# EAGLE design piezo-driver_v0.3-R001 (EAGLE 6.5.0)
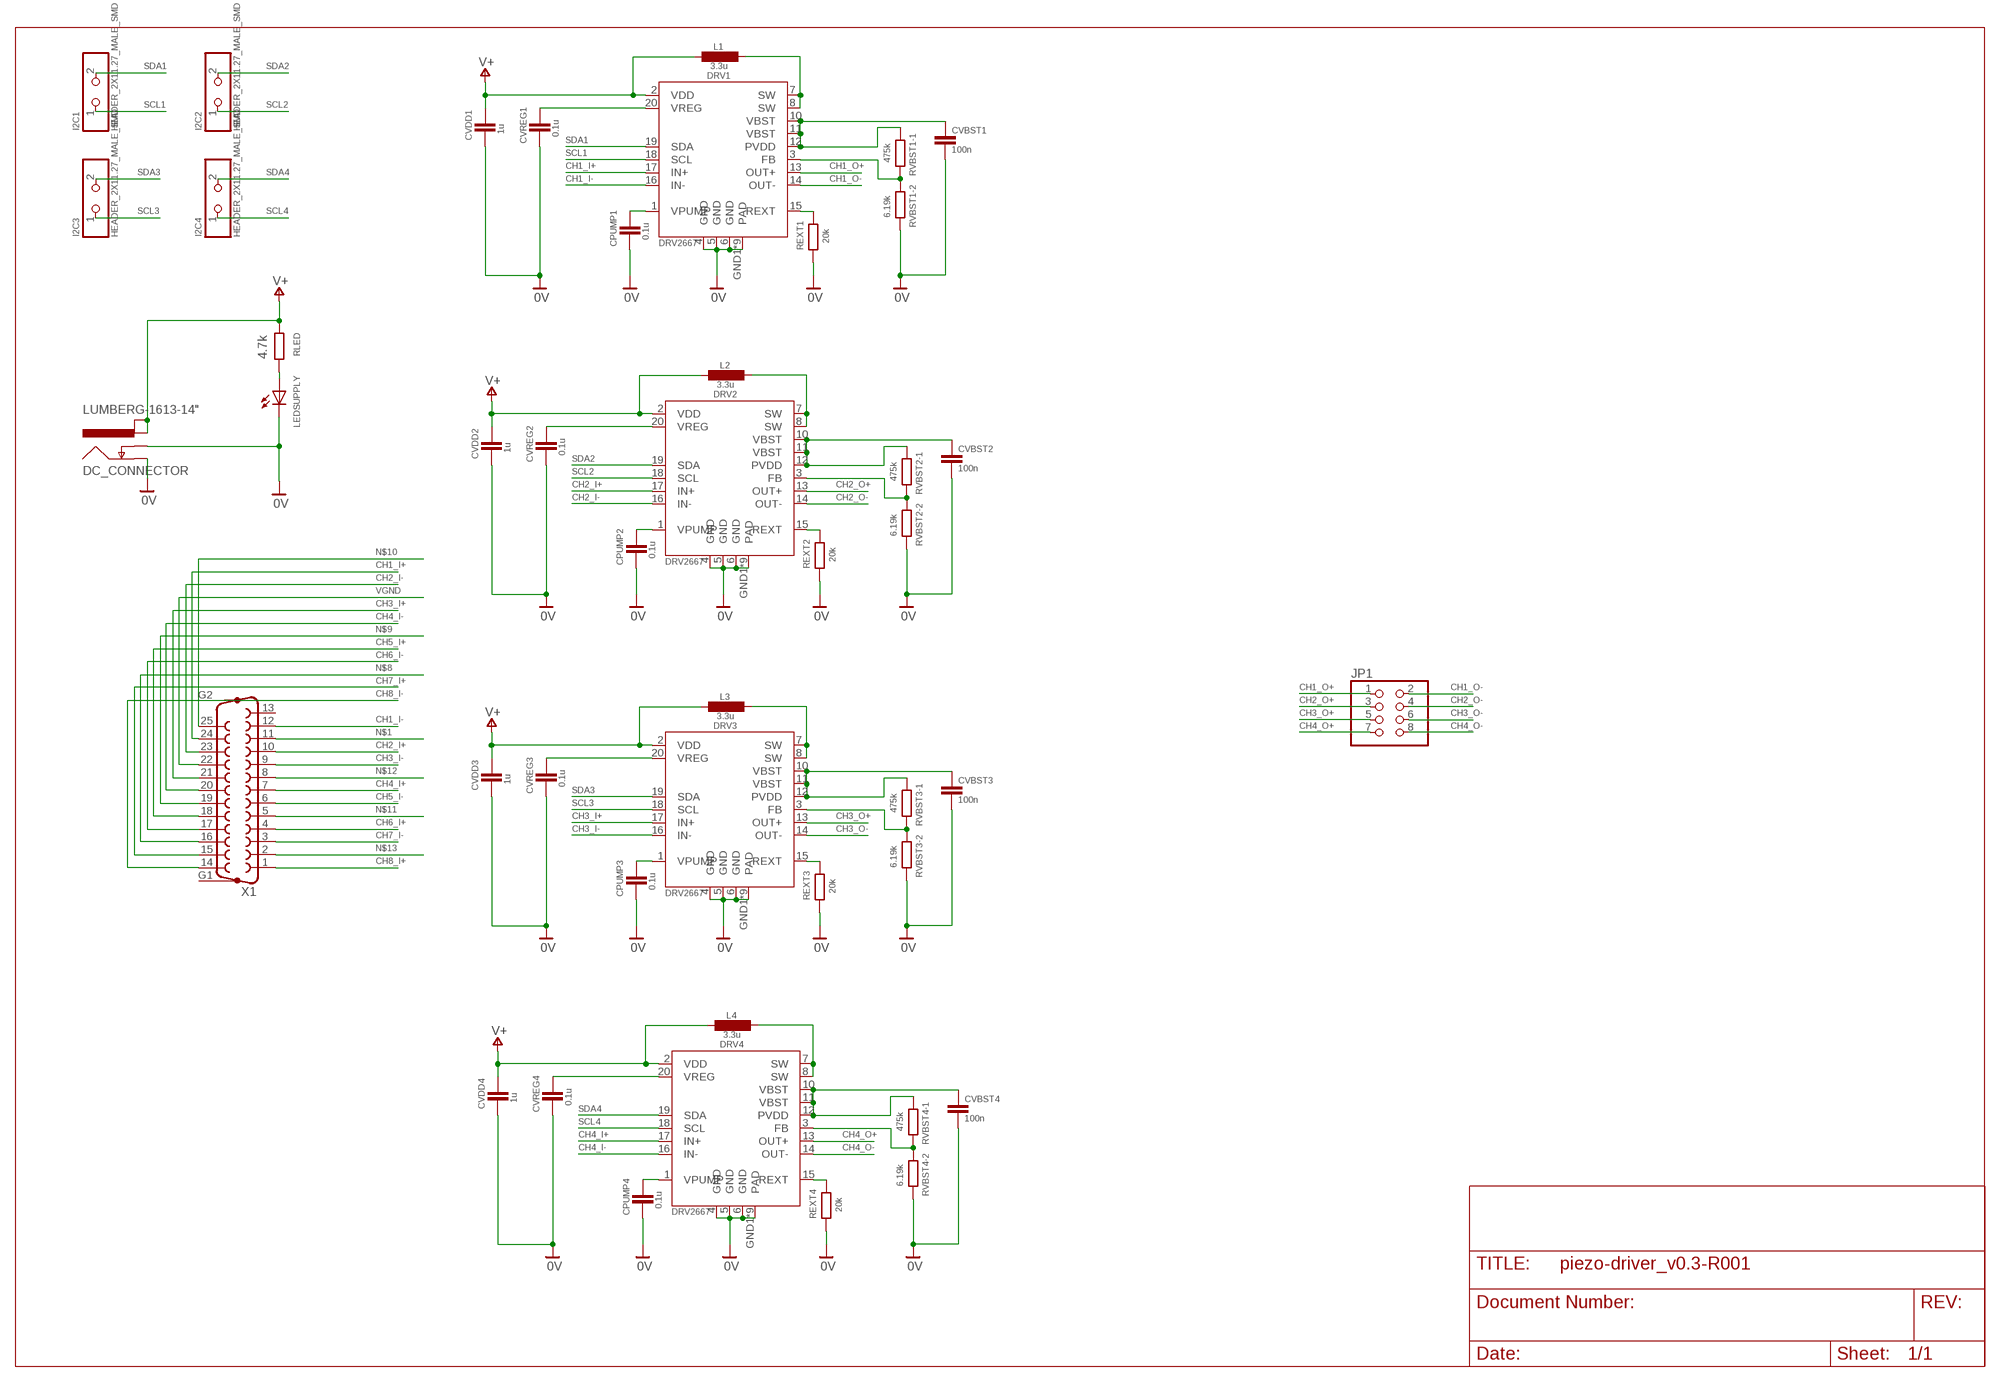
[diagram p0: schematic, sheet 1]

## Parts
CPUMP1  0.1u  C-EUC0805  [C0805]
CPUMP2  0.1u  C-EUC0805  [C0805]
CPUMP3  0.1u  C-EUC0805  [C0805]
CPUMP4  0.1u  C-EUC0805  [C0805]
CVBST1  100n  C-EUC0805  [C0805]
CVBST2  100n  C-EUC0805  [C0805]
CVBST3  100n  C-EUC0805  [C0805]
CVBST4  100n  C-EUC0805  [C0805]
CVDD1  1u  C-EUC0805  [C0805]
CVDD2  1u  C-EUC0805  [C0805]
CVDD3  1u  C-EUC0805  [C0805]
CVDD4  1u  C-EUC0805  [C0805]
CVREG1  0.1u  C-EUC0805  [C0805]
CVREG2  0.1u  C-EUC0805  [C0805]
CVREG3  0.1u  C-EUC0805  [C0805]
CVREG4  0.1u  C-EUC0805  [C0805]
DC_CONNECTOR  LUMBERG-1613-14"  [LUMBERG-1613_14]
DRV1  DRV2667QFN  [QFN400X400]
DRV2  DRV2667QFN  [QFN400X400]
DRV3  DRV2667QFN  [QFN400X400]
DRV4  DRV2667QFN  [QFN400X400]
I2C1  HEADER_2X11.27_MALE_SMD  [2X01_1.27_SMD]
I2C2  HEADER_2X11.27_MALE_SMD  [2X01_1.27_SMD]
I2C3  HEADER_2X11.27_MALE_SMD  [2X01_1.27_SMD]
I2C4  HEADER_2X11.27_MALE_SMD  [2X01_1.27_SMD]
JP1  PINHD-2X4/90  [2X04/90]
L1  3.3u  L-EUL3225M  [L3225M]
L2  3.3u  L-EUL3225M  [L3225M]
L3  3.3u  L-EUL3225M  [L3225M]
L4  3.3u  L-EUL3225M  [L3225M]
LEDSUPPLY  LED0603  [LED-0603]
REXT1  20k  R-EU_R0805  [R0805]
REXT2  20k  R-EU_R0805  [R0805]
REXT3  20k  R-EU_R0805  [R0805]
REXT4  20k  R-EU_R0805  [R0805]
RLED  4.7k  R-EU_R0805  [R0805]
RVBST1-1  475k  R-EU_R0805  [R0805]
RVBST1-2  6.19k  R-EU_R0805  [R0805]
RVBST2-1  475k  R-EU_R0805  [R0805]
RVBST2-2  6.19k  R-EU_R0805  [R0805]
RVBST3-1  475k  R-EU_R0805  [R0805]
RVBST3-2  6.19k  R-EU_R0805  [R0805]
RVBST4-1  475k  R-EU_R0805  [R0805]
RVBST4-2  6.19k  R-EU_R0805  [R0805]
X1  F25HP  [F25HP]

## Nets
0V: CPUMP1.2 CPUMP2.2 CPUMP3.2 CPUMP4.2 CVBST1.2 CVBST2.2 CVBST3.2 CVBST4.2 CVDD1.2 CVDD2.2 CVDD3.2 CVDD4.2 CVREG1.2 CVREG2.2 CVREG3.2 CVREG4.2 DC_CONNECTOR.1(GND) DC_CONNECTOR.2(GND_INS) DRV1.4(GND) DRV1.5(GND) DRV1.6(GND) DRV1.GND1(PAD) DRV1.GND2(PAD) DRV1.GND3(PAD) DRV1.GND4(PAD) DRV1.GND5(PAD) DRV1.GND6(PAD) DRV1.GND7(PAD) DRV1.GND8(PAD) DRV1.GND9(PAD) DRV2.4(GND) DRV2.5(GND) DRV2.6(GND) DRV2.GND1(PAD) DRV2.GND2(PAD) DRV2.GND3(PAD) DRV2.GND4(PAD) DRV2.GND5(PAD) DRV2.GND6(PAD) DRV2.GND7(PAD) DRV2.GND8(PAD) DRV2.GND9(PAD) DRV3.4(GND) DRV3.5(GND) DRV3.6(GND) DRV3.GND1(PAD) DRV3.GND2(PAD) DRV3.GND3(PAD) DRV3.GND4(PAD) DRV3.GND5(PAD) DRV3.GND6(PAD) DRV3.GND7(PAD) DRV3.GND8(PAD) DRV3.GND9(PAD) DRV4.4(GND) DRV4.5(GND) DRV4.6(GND) DRV4.GND1(PAD) DRV4.GND2(PAD) DRV4.GND3(PAD) DRV4.GND4(PAD) DRV4.GND5(PAD) DRV4.GND6(PAD) DRV4.GND7(PAD) DRV4.GND8(PAD) DRV4.GND9(PAD) LEDSUPPLY.C REXT1.1 REXT2.1 REXT3.1 REXT4.1 RVBST1-2.1 RVBST2-2.1 RVBST3-2.1 RVBST4-2.1
CH1_I+: DRV1.17(IN+) X1.24
CH1_I-: DRV1.16(IN-) X1.12
CH1_O+: DRV1.13(OUT+) JP1.1
CH1_O-: DRV1.14(OUT-) JP1.2
CH2_I+: DRV2.17(IN+) X1.10
CH2_I-: DRV2.16(IN-) X1.23
CH2_O+: DRV2.13(OUT+) JP1.3
CH2_O-: DRV2.14(OUT-) JP1.4
CH3_I+: DRV3.17(IN+) X1.21
CH3_I-: DRV3.16(IN-) X1.9
CH3_O+: DRV3.13(OUT+) JP1.5
CH3_O-: DRV3.14(OUT-) JP1.6
CH4_I+: DRV4.17(IN+) X1.7
CH4_I-: DRV4.16(IN-) X1.20
CH4_O+: DRV4.13(OUT+) JP1.7
CH4_O-: DRV4.14(OUT-) JP1.8
CH5_I+: X1.18
CH5_I-: X1.6
CH6_I+: X1.4
CH6_I-: X1.17
CH7_I+: X1.15
CH7_I-: X1.3
CH8_I+: X1.1
CH8_I-: X1.14
N$1: X1.11
N$2: DRV1.7(SW) DRV1.8(SW) L1.1
N$3: CVBST1.1 DRV1.10(VBST) DRV1.11(VBST) DRV1.12(PVDD) RVBST1-1.2
N$4: DRV1.3(FB) RVBST1-1.1 RVBST1-2.2
N$5: DRV1.15(REXT) REXT1.2
N$6: CPUMP1.1 DRV1.1(VPUMP)
N$7: CVREG1.1 DRV1.20(VREG)
N$8: X1.16
N$9: X1.19
N$10: X1.25
N$11: X1.5
N$12: X1.8
N$13: X1.2
N$15: LEDSUPPLY.A RLED.1
N$31: DRV2.7(SW) DRV2.8(SW) L2.1
N$32: CVBST2.1 DRV2.10(VBST) DRV2.11(VBST) DRV2.12(PVDD) RVBST2-1.2
N$33: DRV2.3(FB) RVBST2-1.1 RVBST2-2.2
N$34: DRV2.15(REXT) REXT2.2
N$35: CPUMP2.1 DRV2.1(VPUMP)
N$36: CVREG2.1 DRV2.20(VREG)
N$37: DRV3.7(SW) DRV3.8(SW) L3.1
N$38: CVBST3.1 DRV3.10(VBST) DRV3.11(VBST) DRV3.12(PVDD) RVBST3-1.2
N$39: DRV3.3(FB) RVBST3-1.1 RVBST3-2.2
N$40: DRV3.15(REXT) REXT3.2
N$41: CPUMP3.1 DRV3.1(VPUMP)
N$42: CVREG3.1 DRV3.20(VREG)
N$43: DRV4.7(SW) DRV4.8(SW) L4.1
N$44: CVBST4.1 DRV4.10(VBST) DRV4.11(VBST) DRV4.12(PVDD) RVBST4-1.2
N$45: DRV4.3(FB) RVBST4-1.1 RVBST4-2.2
N$46: DRV4.15(REXT) REXT4.2
N$47: CPUMP4.1 DRV4.1(VPUMP)
N$48: CVREG4.1 DRV4.20(VREG)
SCL1: DRV1.18(SCL) I2C1.1
SCL2: DRV2.18(SCL) I2C2.1
SCL3: DRV3.18(SCL) I2C3.1
SCL4: DRV4.18(SCL) I2C4.1
SDA1: DRV1.19(SDA) I2C1.2
SDA2: DRV2.19(SDA) I2C2.2
SDA3: DRV3.19(SDA) I2C3.2
SDA4: DRV4.19(SDA) I2C4.2
V+: CVDD1.1 CVDD2.1 CVDD3.1 CVDD4.1 DC_CONNECTOR.3(PWR_1) DC_CONNECTOR.4(PWR_2) DRV1.2(VDD) DRV2.2(VDD) DRV3.2(VDD) DRV4.2(VDD) L1.2 L2.2 L3.2 L4.2 RLED.2
VGND: X1.22
Unconnected: X1.13 X1.G1 X1.G2

## Library data of the parts
CPUMP1-CPUMP4 CVBST1-CVBST4 CVDD1-CVDD4 CVREG1-CVREG4 = SABRe:C-EU: CAPACITOR, European symbol
DC_CONNECTOR = SABRe:LUMBERG-1613-14
DRV1-DRV4 = ICST:DRV2667
I2C1-I2C4 = SABRe:HEADER_2X1
JP1 = ICST:PINHD-2X4: PIN HEADER
L1-L4 = SABRe:L-EU: INDUCTOR, European symbol
LEDSUPPLY = SABRe:LED: LEDs Standard schematic elements and footprints for packages: 5mm 3mm 1206 0603
REXT1-REXT4 RVBST1-1 RVBST1-2 RVBST2-1 RVBST2-2 RVBST3-1 RVBST3-2 RVBST4-1 RVBST4-2 = SABRe:R-EU_: RESISTOR, European symbol
RLED = rcl:R-EU_: RESISTOR, European symbol
X1 = ICST:F25HP: SUB-D; OC_FARNELL: unknown; OC_NEWARK: unknown

## Board
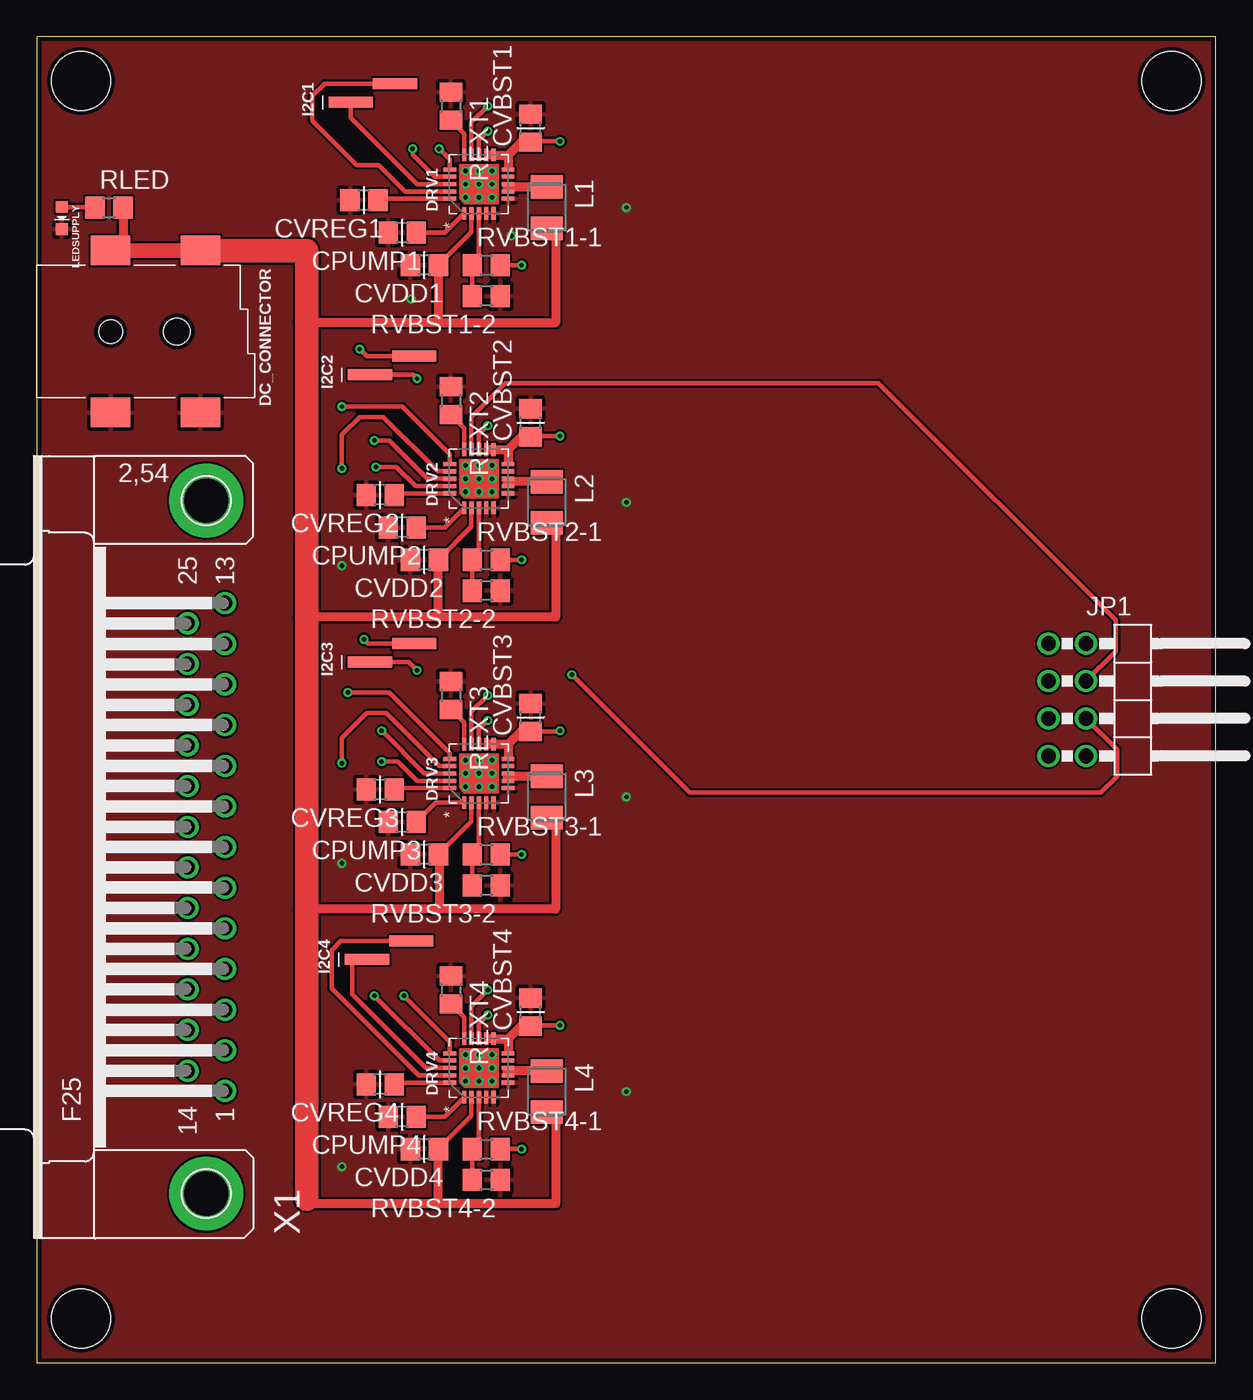
[diagram p1: board, top side]
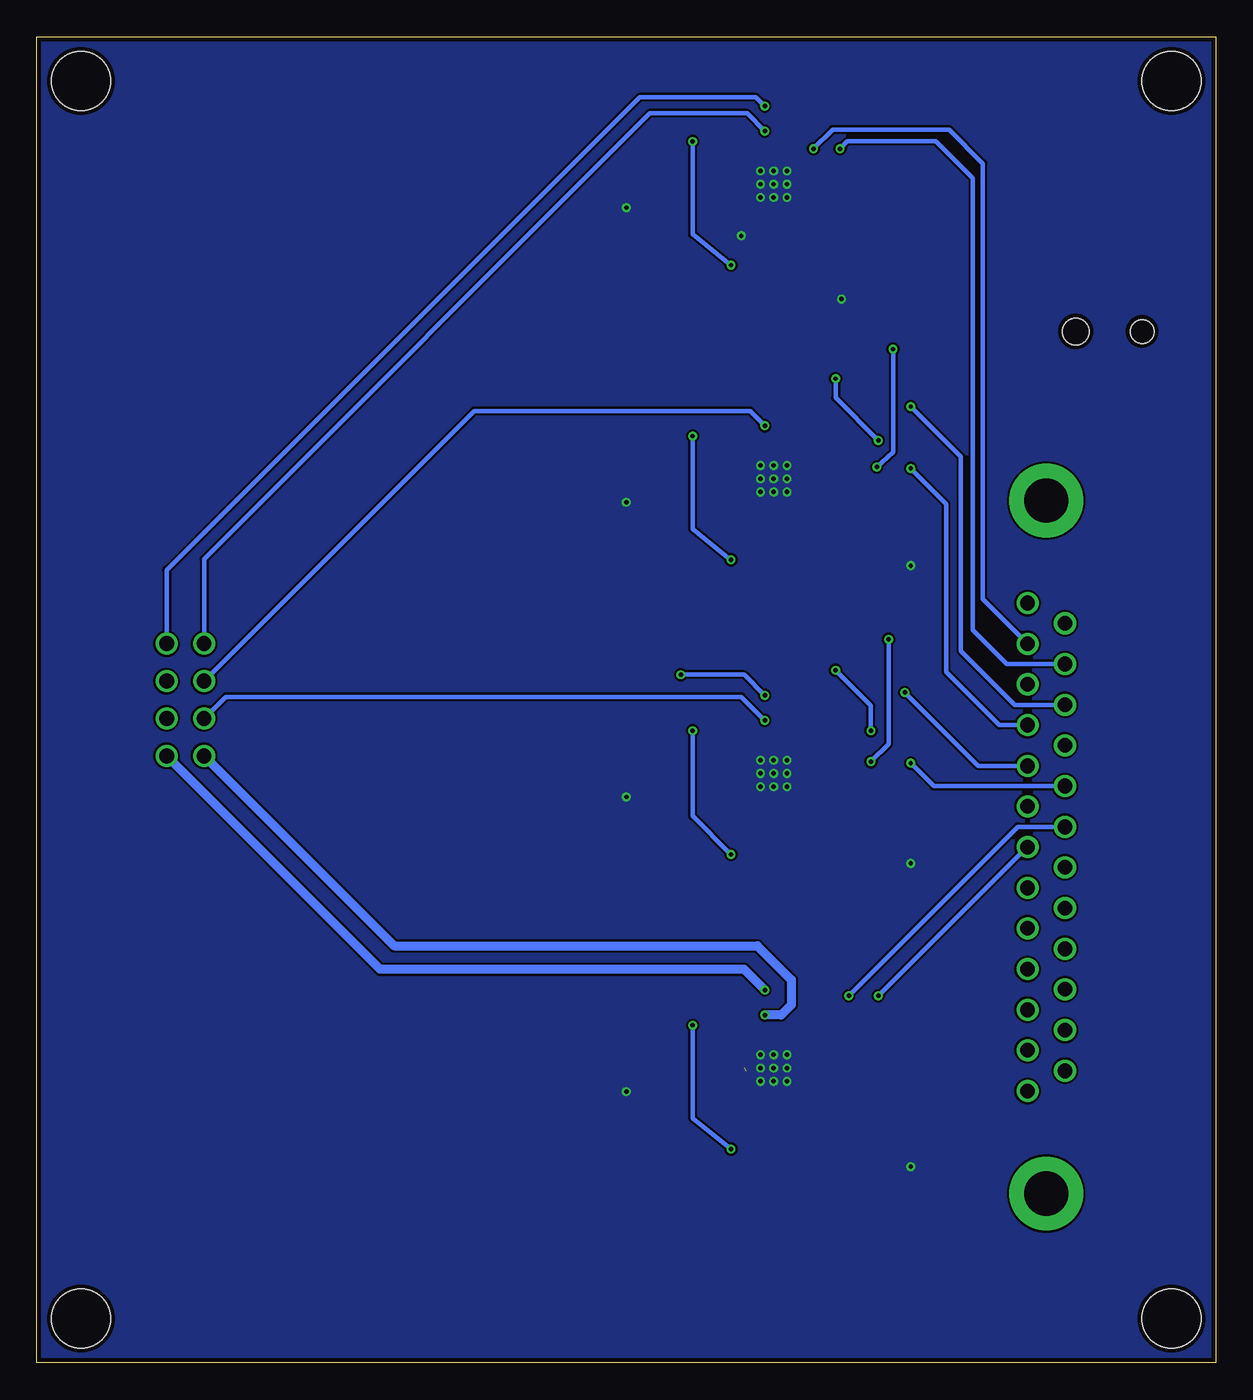
[diagram p2: board, bottom side, seen from below]

Size 80 x 90 mm. Coordinates in mm from the lower left corner, seen from the top.
Outline: 0,90 0,0 80,0 80,90 0,90
Copper layers (1*16): Top 0.035mm / dielectric 1.6mm / Bottom 0.035mm
Design rules "2L-1.6mm-0.15_0.3mm": minimum track width 0.15mm, minimum drill 0.3mm, track to track 0.15mm, track to pad 0.15mm, pad to pad 0.15mm, via to via 0.15mm, smd to smd 0.15mm, copper to edge 0.3mm, drill to drill 0.5mm, minimum pad ring 0.15mm, minimum via ring 0.15mm, stop-mask expansion 0.1mm, vias tented up to drill 0.8mm, thermal gap 0.25mm
Holes 4 mm at 3,87 77,87 77,3 3,3

### Footprints (pad centres in the part's own frame; a part is rotated, then mirrored left to right if it is on the bottom)
C0805 = smd 1.3 x 1.5: 1 -0.95,0; 2 0.95,0
LUMBERG-1613_14 = smd 2 x 2.7: 1 5.5,5; 2 5.5,11.1; 3 -5.5,11.1; 4 -5.5,5 | hole 1.6: 0,5 | hole 1.8: 0,9.5
QFN400X400 = smd 0.85 x 0.28: 1 -1.981,0.991; 2 -1.981,0.508; 3 -1.981,0; 4 -1.981,-0.508; 5 -1.981,-0.991; 11 1.981,-0.991; 12 1.981,-0.508; 13 1.981,0; 14 1.981,0.508; 15 1.981,0.991 | smd 0.28 x 0.85: 6 -0.991,-1.981; 7 -0.508,-1.981; 8 0,-1.981; 9 0.508,-1.981; 10 0.991,-1.981; 16 0.991,1.981; 17 0.508,1.981; 18 0,1.981; 19 -0.508,1.981; 20 -0.991,1.981 | drill 0.3: GND1 -0.9,0.9; GND2 0,0.9; GND3 0.9,0.9; GND4 -0.9,0; GND5 0,0; GND6 0.9,0; GND7 -0.9,-0.9; GND8 0,-0.9; GND9 0.9,-0.9
2X01_1.27_SMD = smd 0.74 x 3: 1 -0.63,1.5; 2 0.63,-1.5
2X04/90 = drill 1: 1 -3.81,-6.35; 2 -3.81,-3.81; 3 -1.27,-6.35; 4 -1.27,-3.81; 5 1.27,-6.35; 6 1.27,-3.81; 7 3.81,-6.35; 8 3.81,-3.81
L3225M = smd 1.6 x 2.2: 1 -1.4,0; 2 1.4,0
LED-0603 = smd 0.8 x 0.8: A 0,-0.75; C 0,0.75
R0805 = smd 1.3 x 1.5: 1 -0.95,0; 2 0.95,0
F25HP = drill 1: 1 -16.561,-1.27; 2 -13.792,-1.27; 3 -11.049,-1.27; 4 -8.28,-1.27; 5 -5.512,-1.27; 6 -2.769,-1.27; 7 0,-1.27; 8 2.769,-1.27; 9 5.512,-1.27; 10 8.28,-1.27; 11 11.049,-1.27; 12 13.792,-1.27; 13 16.561,-1.27; 14 -15.189,1.27; 15 -12.421,1.27; 16 -9.652,1.27; 17 -6.909,1.27; 18 -4.14,1.27; 19 -1.372,1.27; 20 1.372,1.27; 21 4.14,1.27; 22 6.909,1.27; 23 9.652,1.27; 24 12.421,1.27; 25 15.189,1.27 | drill 3 pad 5: G1 -23.52,0; G2 23.52,0

### Placement (x,y rotation side)
CPUMP1  24.8,76.7 180 top
CPUMP2  24.8,56.7 180 top
CPUMP3  24.8,36.7 180 top
CPUMP4  24.8,16.7 180 top
CVBST1  33.5,83.8 90 top
CVBST2  33.5,63.8 90 top
CVBST3  33.5,43.8 90 top
CVBST4  33.5,23.8 90 top
CVDD1  26.3,74.5 180 top
CVDD2  26.3,54.5 180 top
CVDD3  26.3,34.5 180 top
CVDD4  26.3,14.5 180 top
CVREG1  22.2,78.9 180 top
CVREG2  23.3,58.9 180 top
CVREG3  23.3,38.9 180 top
CVREG4  23.3,18.9 180 top
DC_CONNECTOR  0,70 270 top
DRV1  30,80 90 top
DRV2  30,60 90 top
DRV3  30,40 90 top
DRV4  30,20 90 top
I2C1  22.8,86.2 90 top
I2C2  24.1,67.7 90 top
I2C3  24.1,48.2 90 top
I2C4  23.9,28 90 top
JP1  75,45 270 top
L1  34.6,78.4 270 top
L2  34.6,58.4 270 top
L3  34.6,38.4 270 top
L4  34.6,18.4 270 top
LEDSUPPLY  1.7,77.7 180 top
REXT1  28.1,85.3 270 top
REXT2  28.1,65.3 270 top
REXT3  28.1,45.3 270 top
REXT4  28.1,25.3 270 top
RLED  4.9,78.4 0 top
RVBST1-1  30.5,74.5 0 top
RVBST1-2  30.5,72.4 180 top
RVBST2-1  30.5,54.5 0 top
RVBST2-2  30.5,52.4 180 top
RVBST3-1  30.5,34.5 0 top
RVBST3-2  30.5,32.4 180 top
RVBST4-1  30.5,14.5 0 top
RVBST4-2  30.5,12.4 180 top
X1  11.5,35 90 top

### Tracks (layer width: path | path; a pad name or v marks a point on that pad's centre or on a via)
0V  (via drill 0.3)
  other vias: 25.4,72.2 32.2,76.5 20.7,33.9 20.7,54.1 20.7,13.3 40,38.4 40,58.4 40,78.4 40,18.4
  pour Top: 0,90 0,0 80,0 80,90
  pour Bottom: 0,90 0,0 80,0 80,90
CH1_I+  (via drill 0.3)
  Top 0.3: DRV1.17 26.99,80.51 25.5,82 v25.5,82.4
  Bottom 0.3: X1.24 14.2,47.42 16.5,49.72 16.5,80.4 19,82.9 25,82.9 v25.5,82.4
CH1_I-  (via drill 0.3)
  Top 0.3: DRV1.16 28.02,81.68 v27.3,82.4
  Bottom 0.3: X1.12 15.8,51.82 15.8,81.4 18.1,83.7 26,83.7 v27.3,82.4
CH1_O+  (via drill 0.3)
  Top 0.3: DRV1.13 30,83 v30.6,83.6
  Bottom 0.3: v30.6,83.6 31.8,84.8 38.4,84.8 68.65,54.55 JP1.1
CH1_O-  (via drill 0.3)
  Top 0.3: DRV1.14 29.49,84.19 v30.6,85.3
  Bottom 0.3: v30.6,85.3 31.2,85.9 39.1,85.9 71.19,53.81 JP1.2
CH2_I+  (via drill 0.3)
  Top 0.3: v20.7,60.7 20.7,63 21.9,64.2 23.5,64.2 27.19,60.51 DRV2.17
  Bottom 0.3: X1.10 14.68,43.28 18.3,46.9 18.3,58.3 v20.7,60.7
CH2_I-  (via drill 0.3)
  Top 0.3: v20.7,64.9 24.8,64.9 28.02,61.68 DRV2.16
  Bottom 0.3: X1.23 13.65,44.65 17.3,48.3 17.3,61.5 v20.7,64.9
CH2_O+  (via drill 0.3)
  Top 0.3: DRV2.13 30,63 v30.6,63.6
  Bottom 0.3: v30.6,63.6 31.6,64.6 50.32,64.6 JP1.3
CH2_O-
  Top 0.3: DRV2.14 29.49,64.19 31.8,66.5 57.1,66.5 73.2,50.4 73.2,48.28 JP1.4
CH3_I+  (via drill 0.3)
  Top 0.3: DRV3.17 27.29,40.51 23.7,44.1 22.4,44.1 20.7,42.4 v20.7,40.7
  Bottom 0.3: v20.7,40.7 19.14,39.14 X1.21
CH3_I-  (via drill 0.3)
  Top 0.3: v21.1,45.5 23.9,45.5 28.02,41.38 DRV3.16
  Bottom 0.3: X1.9 16.11,40.51 v21.1,45.5
CH3_O+  (via drill 0.3)
  Top 0.3: DRV3.13 30,43 v30.6,43.6
  Bottom 0.3: v30.6,43.6 32.2,45.2 67.18,45.2 JP1.5
CH3_O-  (via drill 0.3)
  Top 0.3: DRV3.14 29.49,44.19 v30.6,45.3 | v36.3,46.7 44.3,38.7 72.2,38.7 73.3,39.8 73.3,41.62 JP1.6
  Bottom 0.3: v30.6,45.3 32,46.7 v36.3,46.7
CH4_I+  (via drill 0.3)
  Top 0.3: v22.9,24.9 27.29,20.51 DRV4.17
  Bottom 0.3: X1.7 12.8,35 v22.9,24.9
CH4_I-  (via drill 0.3)
  Top 0.3: DRV4.16 28.02,21.78 v24.9,24.9
  Bottom 0.3: v24.9,24.9 13.43,36.37 X1.20
CH4_O+  (via drill 0.3)
  Top 0.3: DRV4.13 30,23 v30.6,23.6
  Bottom 0.6: v30.6,23.6 29.5,23.6 28.8,24.3 28.8,26 31.1,28.3 55.76,28.3 JP1.7
CH4_O-  (via drill 0.3)
  Top 0.3: DRV4.14 29.49,24.19 v30.6,25.3
  Bottom 0.6: JP1.8 56.7,26.7 32,26.7 v30.6,25.3
N$2
  Top 0.3: DRV1.7 DRV1.8 32,79.98 32,79.8
  Top 0.6: L1.1 32,79.8 31.9,79.8
N$3  (via drill 0.3)
  Top 0.3: DRV1.11 30.99,82 | RVBST1-1.2 v32.9,74.5 | v35.5,82.9 33.5,82.9 CVBST1.1 | 30.7,81.98 DRV1.12 | 32,81.2 31.98,81.18 DRV1.10
  Top 0.6: 32,81.98 DRV1.11 30.7,81.98 | 32,81.98 32,81.2 | 32,81.98 32.87,82.85 CVBST1.1
  Bottom 0.3: v32.9,74.5 35.5,76.6 v35.5,82.9
N$4
  Top 0.3: DRV1.3 30,74.9 RVBST1-1.1 RVBST1-2.2
N$5
  Top 0.3: DRV1.15 29.01,83.44 REXT1.2
N$6
  Top 0.3: DRV1.1 27.69,76.7 CPUMP1.1
N$7
  Top 0.3: DRV1.20 23.15,79.01 CVREG1.1
N$15
  Top 0.3: RLED.1 3.9,78.45 LEDSUPPLY.A
N$31
  Top 0.3: DRV2.7 DRV2.8 32,59.98 32,59.8
  Top 0.6: L2.1 32,59.8 31.9,59.8
N$32  (via drill 0.3)
  Top 0.3: RVBST2-1.2 v32.9,54.5 | v35.5,62.9 33.5,62.9 CVBST2.1 | 30.7,61.98 DRV2.12 | 32,61.2 31.98,61.18 DRV2.10
  Top 0.6: 32,61.98 DRV2.11 30.7,61.98 | 32,61.98 32,61.2 | 32,61.98 32.87,62.85 CVBST2.1
  Bottom 0.3: v32.9,54.5 35.5,56.6 v35.5,62.9
N$33
  Top 0.3: DRV2.3 30,54.55 RVBST2-1.1 RVBST2-2.2
N$34
  Top 0.3: DRV2.15 29.01,63.44 REXT2.2
N$35
  Top 0.3: DRV2.1 27.69,56.7 CPUMP2.1
N$36
  Top 0.3: DRV2.20 24.25,59.01 CVREG2.1
N$37
  Top 0.3: DRV3.7 DRV3.8 32,39.98 32,39.8
  Top 0.6: L3.1 32,39.8 31.9,39.8
N$38  (via drill 0.3)
  Top 0.3: RVBST3-1.2 v32.9,34.5 | v35.5,42.9 35.45,42.85 CVBST3.1 | DRV3.12 DRV3.11 | 32,41.2 31.98,41.18 DRV3.10
  Top 0.6: 32,41.98 DRV3.11 30.7,41.98 | 32,41.98 32,41.2 | 32,41.98 32.87,42.85 CVBST3.1
  Bottom 0.3: v32.9,34.5 35.5,37.1 v35.5,42.9
N$39
  Top 0.3: RVBST3-2.2 RVBST3-1.1 30,34.95 DRV3.3
N$40
  Top 0.3: DRV3.15 29.01,43.44 REXT3.2
N$41
  Top 0.3: DRV3.1 27.07,38.02 CPUMP3.1
N$42
  Top 0.3: DRV3.20 24.25,39.01 CVREG3.1
N$43  (1 unrouted)
  Top 0.3: DRV4.8 DRV4.7
  Top 0.6: L4.1 31.9,19.8
N$44  (via drill 0.3)
  Top 0.3: RVBST4-1.2 v32.9,14.5 | v35.5,22.9 33.5,22.9 CVBST4.1 | DRV4.12 DRV4.11 | 32,21.2 31.98,21.18 DRV4.10
  Top 0.6: 32,21.98 DRV4.11 30.7,21.98 | 32,21.98 32,21.2 | 32,21.98 32.87,22.85 CVBST4.1
  Bottom 0.3: v32.9,14.5 35.5,16.6 v35.5,22.9
N$45
  Top 0.3: DRV4.3 30,14.55 RVBST4-1.1 RVBST4-2.2
N$46
  Top 0.3: DRV4.15 29.01,23.44 REXT4.2
N$47
  Top 0.3: DRV4.1 27.69,16.7 CPUMP4.1
N$48
  Top 0.3: DRV4.20 24.25,19.01 CVREG4.1
SCL1
  Top 0.3: DRV1.18 25.8,80 21.3,84.5 I2C1.1
SCL2  (via drill 0.3)
  Top 0.3: DRV2.18 26.5,60 23.9,62.6 v22.9,62.6 | I2C2.1 25.53,67.07 v25.8,66.8
  Bottom 0.3: v25.8,66.8 25.8,65.5 v22.9,62.6
SCL3  (via drill 0.3)
  Top 0.3: DRV3.18 26.3,40 v23.4,42.9 | v25.8,47 25.23,47.57 I2C3.1
  Bottom 0.3: v23.4,42.9 23.4,44.6 v25.8,47
SCL4
  Top 0.3: DRV4.18 26.4,20 21.4,25 21.4,27.37 I2C4.1
SDA1
  Top 0.3: DRV1.19 25.01,79.49 23.2,81.3 21.7,81.3 18.7,84.3 18.7,86 19.53,86.83 I2C1.2
SDA2  (via drill 0.3)
  Top 0.3: DRV2.19 25.71,59.49 24.4,60.8 v23,60.8 | I2C2.2 22.37,68.33 v21.9,68.8
  Bottom 0.3: v21.9,68.8 21.9,61.8 v23,60.8
SDA3  (via drill 0.3)
  Top 0.3: DRV3.19 25.81,39.49 24.5,40.8 v23.4,40.8 | v22.2,49.1 22.47,48.83 I2C3.2
  Bottom 0.3: v23.4,40.8 22.2,42 v22.2,49.1
SDA4
  Top 0.3: DRV4.19 25.91,19.49 20,25.4 20,28 20.63,28.63 I2C4.2
V+
  Top 0.3: DRV1.2 29.49,76.74 CVDD1.1 | DRV2.2 29.49,56.74 CVDD2.1 | DRV4.2 29.49,16.74 CVDD4.1 | DRV3.2 29.49,36.74 CVDD3.1
  Top 0.6: RLED.2 5.85,75.5 DC_CONNECTOR.4 | 11.4,75.5 DC_CONNECTOR.3 | L1.2 35.2,77 35.2,70.6 27.25,70.6 | CVDD1.1 27.25,70.6 | 27.25,70.6 18.3,70.6 | L2.2 35.2,57 35.2,50.6 27.25,50.6 | 27.25,50.6 CVDD2.1 | 27.25,50.6 18.3,50.6 | L3.2 35.2,37 35.2,30.8 27.3,30.8 | 27.3,30.8 18.3,30.8 | CVDD3.1 27.3,34.5 27.3,30.8 | L4.2 35.2,17 35.2,10.8 27.25,10.8 | 27.25,10.8 CVDD4.1 | 27.25,10.8 18.3,10.8 18.3,12.1
  Top 1: DC_CONNECTOR.3 DC_CONNECTOR.4
  Top 1.6: 11.4,75.5 18.3,75.5 18.3,70.6 18.3,50.6 18.3,30.8 18.3,12.1 18.3,11.1